# Altium schematic sheet GSM Un Used.SchDoc: Unused Modem Pins
size 292 x 193 mm; SheetNumber: 10; SheetTotal: 9
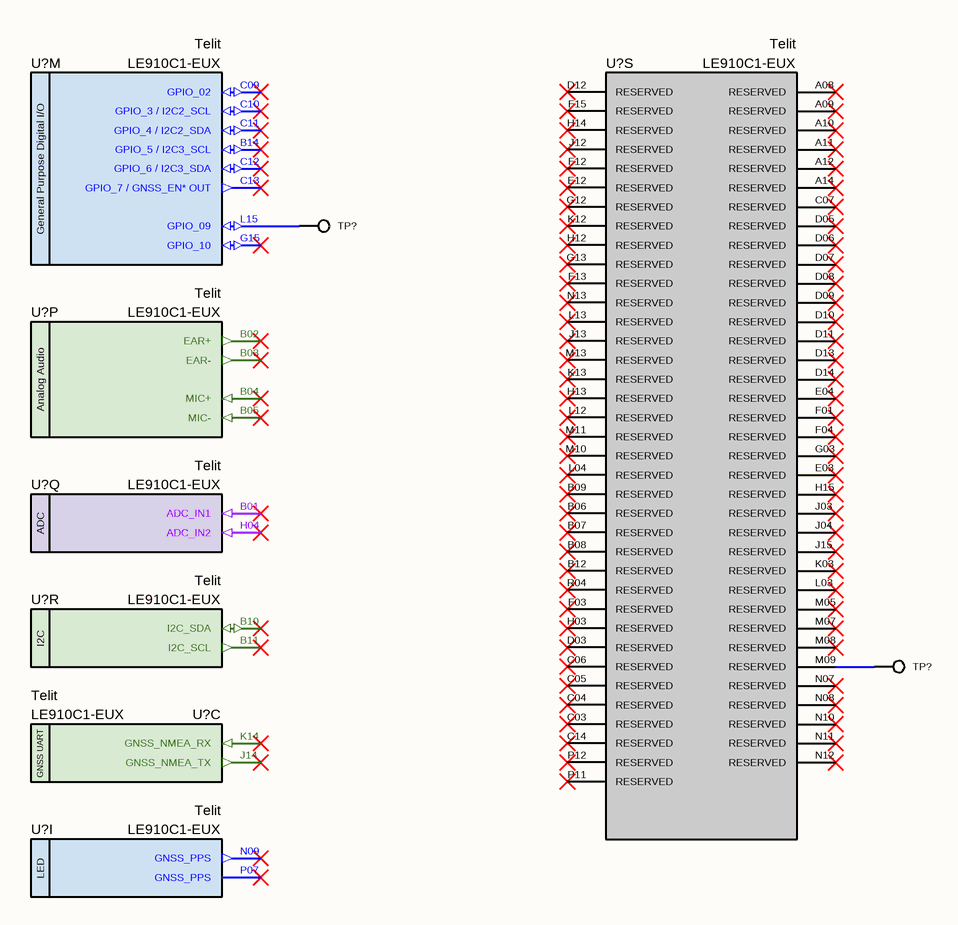
[diagram p0: GSM Un Used.SchDoc]

## Parts
(Parts that share a designator on the sheet are numbered #1, #2 ... from top to bottom, then left to right.)
TP?#1  PCB - Test Point  [TP]  (value not drawn)  (no BOM)
TP?#2  PCB - Test Point  [TP]  (value not drawn)  (no BOM)
U?#1  Manufacturer Part Number: LE910C1-EUX  Manufacturer Name: Telit  [LE910 GSM Modem]  (hidden comment: LE910C1-EUX LTE GSM Module)  (part M of 19)
U?#2  Manufacturer Part Number: LE910C1-EUX  Manufacturer Name: Telit  [LE910 GSM Modem]  (hidden comment: LE910C1-EUX LTE GSM Module)  (part S of 19)
U?#3  Manufacturer Part Number: LE910C1-EUX  Manufacturer Name: Telit  [LE910 GSM Modem]  (hidden comment: LE910C1-EUX LTE GSM Module)  (part P of 19)
U?#4  Manufacturer Part Number: LE910C1-EUX  Manufacturer Name: Telit  [LE910 GSM Modem]  (hidden comment: LE910C1-EUX LTE GSM Module)  (part Q of 19)
U?#5  Manufacturer Part Number: LE910C1-EUX  Manufacturer Name: Telit  [LE910 GSM Modem]  (hidden comment: LE910C1-EUX LTE GSM Module)  (part R of 19)
U?#6  Manufacturer Part Number: LE910C1-EUX  Manufacturer Name: Telit  [LE910 GSM Modem]  (hidden comment: LE910C1-EUX LTE GSM Module)  (part C of 19)
U?#7  Manufacturer Part Number: LE910C1-EUX  Manufacturer Name: Telit  [LE910 GSM Modem]  (hidden comment: LE910C1-EUX LTE GSM Module)  (part I of 19)

## Nets
NetTP?#1_1: TP?#1.1 U?#1.L15(GPIO_09)
NetTP?#2_1: TP?#2.1 U?#2.M09(RESERVED)

Not connected (* = marked no-connect by the designer): U?#1 B14(GPIO_5_/_I2C3_SCL)* C09(GPIO_02)* C10(GPIO_3_/_I2C2_SCL)* C11(GPIO_4_/_I2C2_SDA)* C12(GPIO_6_/_I2C3_SDA)* C13(GPIO_7_/_GNSS_EN*_OUT)* G15(GPIO_10)*; U?#2 A08(RESERVED)* A09(RESERVED)* A10(RESERVED)* A11(RESERVED)* A12(RESERVED)* A14(RESERVED)* B06(RESERVED)* B07(RESERVED)* B08(RESERVED)* B09(RESERVED)* B12(RESERVED)* C03(RESERVED)* C04(RESERVED)* C05(RESERVED)* C06(RESERVED)* C07(RESERVED)* C14(RESERVED)* D03(RESERVED)* D05(RESERVED)* D06(RESERVED)* D07(RESERVED)* D08(RESERVED)* D09(RESERVED)* D10(RESERVED)* D11(RESERVED)* D12(RESERVED)* D13(RESERVED)* D14(RESERVED)* E03(RESERVED)* E04(RESERVED)* E12(RESERVED)* F01(RESERVED)* F03(RESERVED)* F04(RESERVED)* F12(RESERVED)* F13(RESERVED)* F15(RESERVED)* G03(RESERVED)* G12(RESERVED)* G13(RESERVED)* H03(RESERVED)* H12(RESERVED)* H13(RESERVED)* H14(RESERVED)* H15(RESERVED)* J03(RESERVED)* J04(RESERVED)* J12(RESERVED)* J13(RESERVED)* J15(RESERVED)* K03(RESERVED)* K12(RESERVED)* K13(RESERVED)* L03(RESERVED)* L04(RESERVED)* L12(RESERVED)* L13(RESERVED)* M05(RESERVED)* M07(RESERVED)* M08(RESERVED)* M10(RESERVED)* M11(RESERVED)* M13(RESERVED)* N07(RESERVED)* N08(RESERVED)* N10(RESERVED)* N11(RESERVED)* N12(RESERVED)* N13(RESERVED)* P11(RESERVED)* P12(RESERVED)* R04(RESERVED)*; U?#3 B02(EAR+)* B03(EAR-)* B04(MIC+)* B05(MIC-)*; U?#4 B01(ADC_IN1)* H04(ADC_IN2)*; U?#5 B10(I2C_SDA)* B11(I2C_SCL)*; U?#6 J14(GNSS_NMEA_TX)* K14(GNSS_NMEA_RX)*; U?#7 N09(GNSS_PPS)* P07(GNSS_PPS)*

## Notes on the sheet
- © 2026 All rights reserved.
  This document may not, in whole or in part, be copied, photocopied, reproduced, translated or converted to any electronic or machine readable from without prior written permission of Mehmet Günce Akkoyun.
  Engineer contact : akkoyun@me.com
- Property of
- Engineer :
- Date :
- Size :
- A4
- Time :
- Project :
- Page :
- /
- Customer :
- Product ID :
- Module ID :
- Version :
- File :
- Revision :
- (in symbol IC - LE910C1-EUX, part C) GNSS UART
- (in symbol IC - LE910C1-EUX, part I) LED
- (in symbol IC - LE910C1-EUX, part M) General Purpose Digital I/O
- (in symbol IC - LE910C1-EUX, part P) Analog Audio
- (in symbol IC - LE910C1-EUX, part Q) ADC
- (in symbol IC - LE910C1-EUX, part R) I2C

## Library data of the parts
TP?#1 TP?#2 = PCB - Test Point: Test Point
U?#1-U?#7 = IC - LE910C1-EUX: Telit LE910C1-EUX LTE/2G GSM Module; Case: BGA